# EAGLE design Motors-power-board (EAGLE 9.5.2)
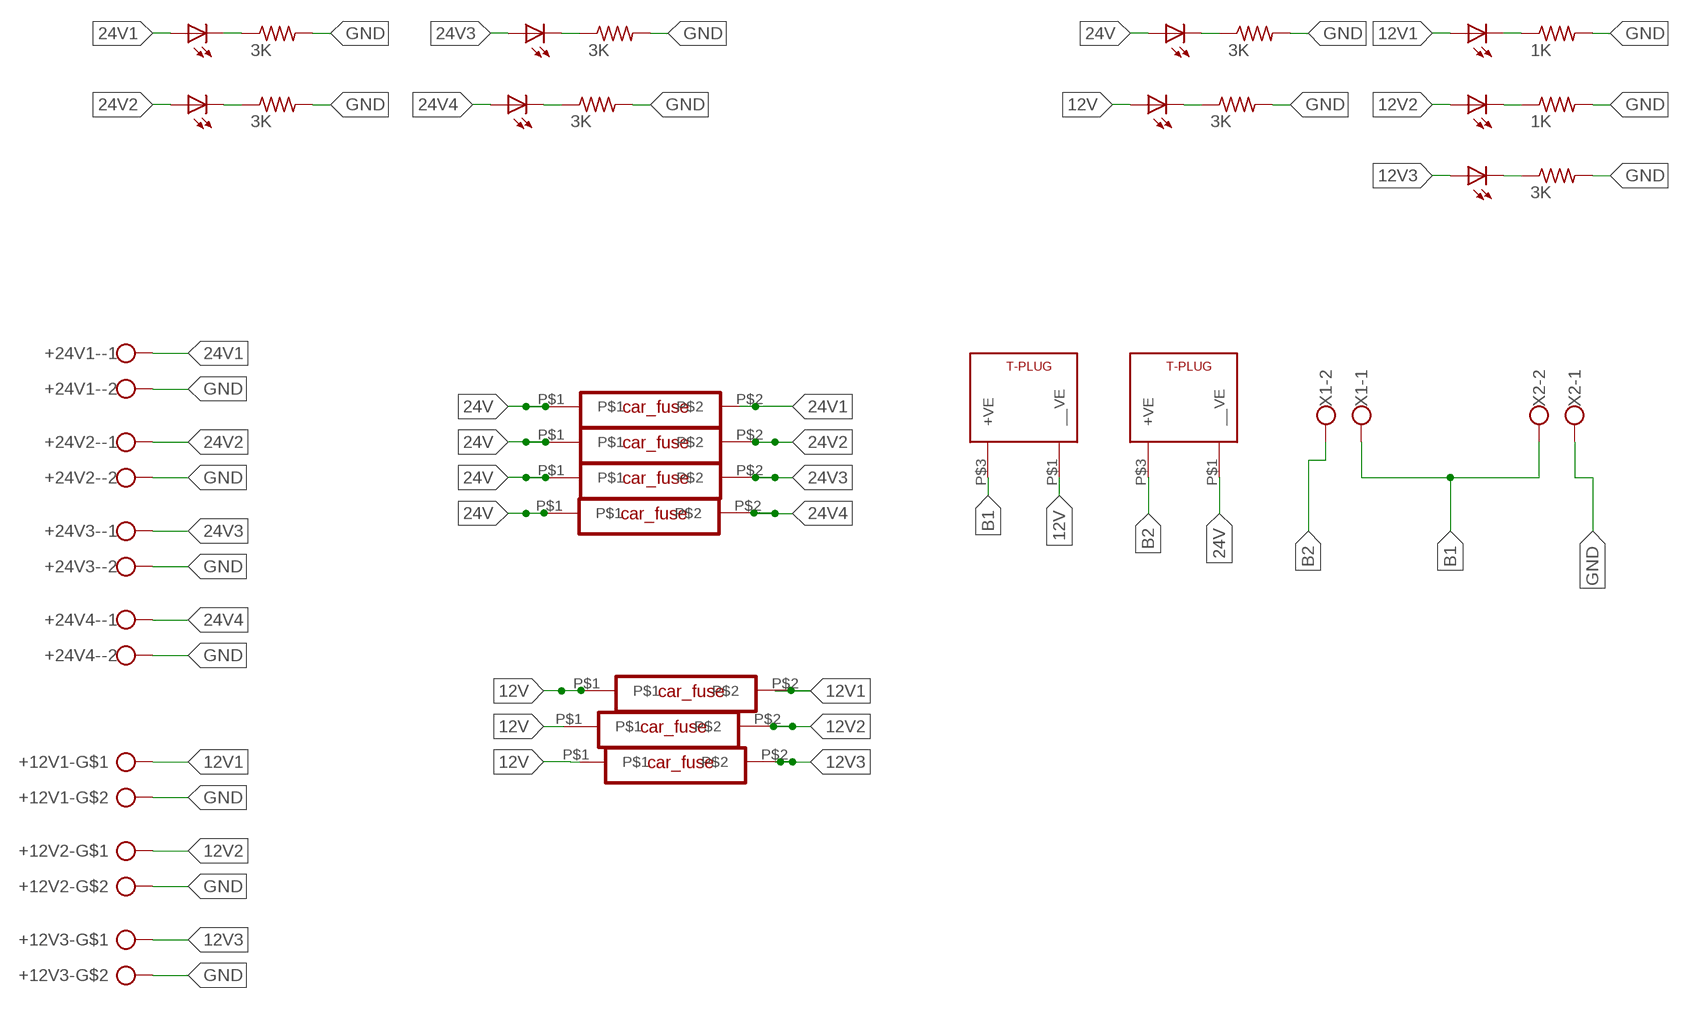
[diagram p0: schematic, sheet 1]

## Parts
1K1  3K  RES-7  [0204/7]
1K2  1K  RES-7  [0204/7]
+12V1-  CON_PTR_2  [AK300/2]
+12V2-  CON_PTR_2  [AK300/2]
+12V3-  CON_PTR_2  [AK300/2]
+24V1-  ROSTA.POWER  [W239-302]
+24V2-  ROSTA.POWER  [W239-302]
+24V3-  ROSTA.POWER  [W239-302]
+24V4-  ROSTA.POWER  [W239-302]
U$4  LED24V  LED3MM  [LED3MM]
U$5  T_CONNECTOR  [T-PLUG]
U$6  T_CONNECTOR  [T-PLUG]
U$8  3K  RES-7  [0204/7]
U$9  3K  RES-7  [0204/7]
U$10  CAR_FUSE  [CAR_FUSE]
U$11  CAR_FUSE  [CAR_FUSE]
U$12  CAR_FUSE  [CAR_FUSE]
U$13  CAR_FUSE  [CAR_FUSE]
U$14  CAR_FUSE  [CAR_FUSE]
U$15  CAR_FUSE  [CAR_FUSE]
U$16  CAR_FUSE  [CAR_FUSE]
U$18  LED5V2  LED3MM  [LED3MM]
U$19  LED5V1  LED3MM  [LED3MM]
U$20  LED24V  LED3MM  [LED3MM]
U$21  LED12V  LED3MM  [LED3MM]
U$22  3K  RES-7  [0204/7]
U$23  3K  RES-7  [0204/7]
U$24  3K  RES-7  [0204/7]
U$25  LED5V2  LED3MM  [LED3MM]
U$26  LED5V1  LED3MM  [LED3MM]
U$27  LED24V  LED3MM  [LED3MM]
U$28  LED24V  LED3MM  [LED3MM]
U$29  1K  RES-7  [0204/7]
U$31  3K  RES-7  [0204/7]
X1  ROSTA.POWER  [W239-302]
X2  ROSTA.POWER  [W239-302]

## Nets
12V: U$5.P$1(__VE) U$14.P$1 U$15.P$1 U$16.P$1 U$28.A
12V1: +12V1-.1 U$14.P$2 U$25.A
12V2: +12V2-.1 U$15.P$2 U$26.A
12V3: +12V3-.1 U$16.P$2 U$27.A
24V: U$4.A U$6.P$1(__VE) U$10.P$1 U$11.P$1 U$12.P$1 U$13.P$1
24V1: +24V1-.1 U$10.P$2 U$18.A
24V2: +24V2-.1 U$11.P$2 U$19.A
24V3: +24V3-.1 U$12.P$2 U$20.A
24V4: +24V4-.1 U$13.P$2 U$21.A
B1: U$5.P$3(+VE) X1.1 X2.2
B2: U$6.P$3(+VE) X1.2
GND: 1K1.2 1K2.2 +12V1-.2 +12V2-.2 +12V3-.2 +24V1-.2 +24V2-.2 +24V3-.2 +24V4-.2 U$8.2 U$9.2 U$22.2 U$23.2 U$24.2 U$29.2 U$31.2 X2.1
N$1: 1K1.1 U$18.K(C)
N$2: U$19.K(C) U$22.1
N$3: U$21.K(C) U$23.1
N$4: U$20.K(C) U$24.1
N$5: 1K2.1 U$25.K(C)
N$6: U$26.K(C) U$29.1
N$9: U$8.1 U$28.K(C)
N$10: U$4.K(C) U$9.1
N$12: U$27.K(C) U$31.1

## Library data of the parts
1K1 1K2 U$8 U$9 U$22-U$24 U$29 U$31 = MIA_LIBRARY-2-2-2:RES-7
+12V1- +12V2- +12V3- = MIA_LIBRARY-2-2-2:CON_PTR_2
+24V1- +24V2- +24V3- +24V4- X1 X2 = MIA_LIBRARY-2-2-2:ROSTA.POWER: WAGO SCREW CLAMP; OC_FARNELL: unknown; OC_NEWARK: unknown
U$4 U$18-U$21 U$25-U$28 = MIA_LIBRARY-2-2-2:LED3MM
U$5 U$6 = MIA_LIBRARY-2-2-2:T_CONNECTOR
U$10-U$16 = MIA_LIBRARY-2-2-2:CAR_FUSE

## Board
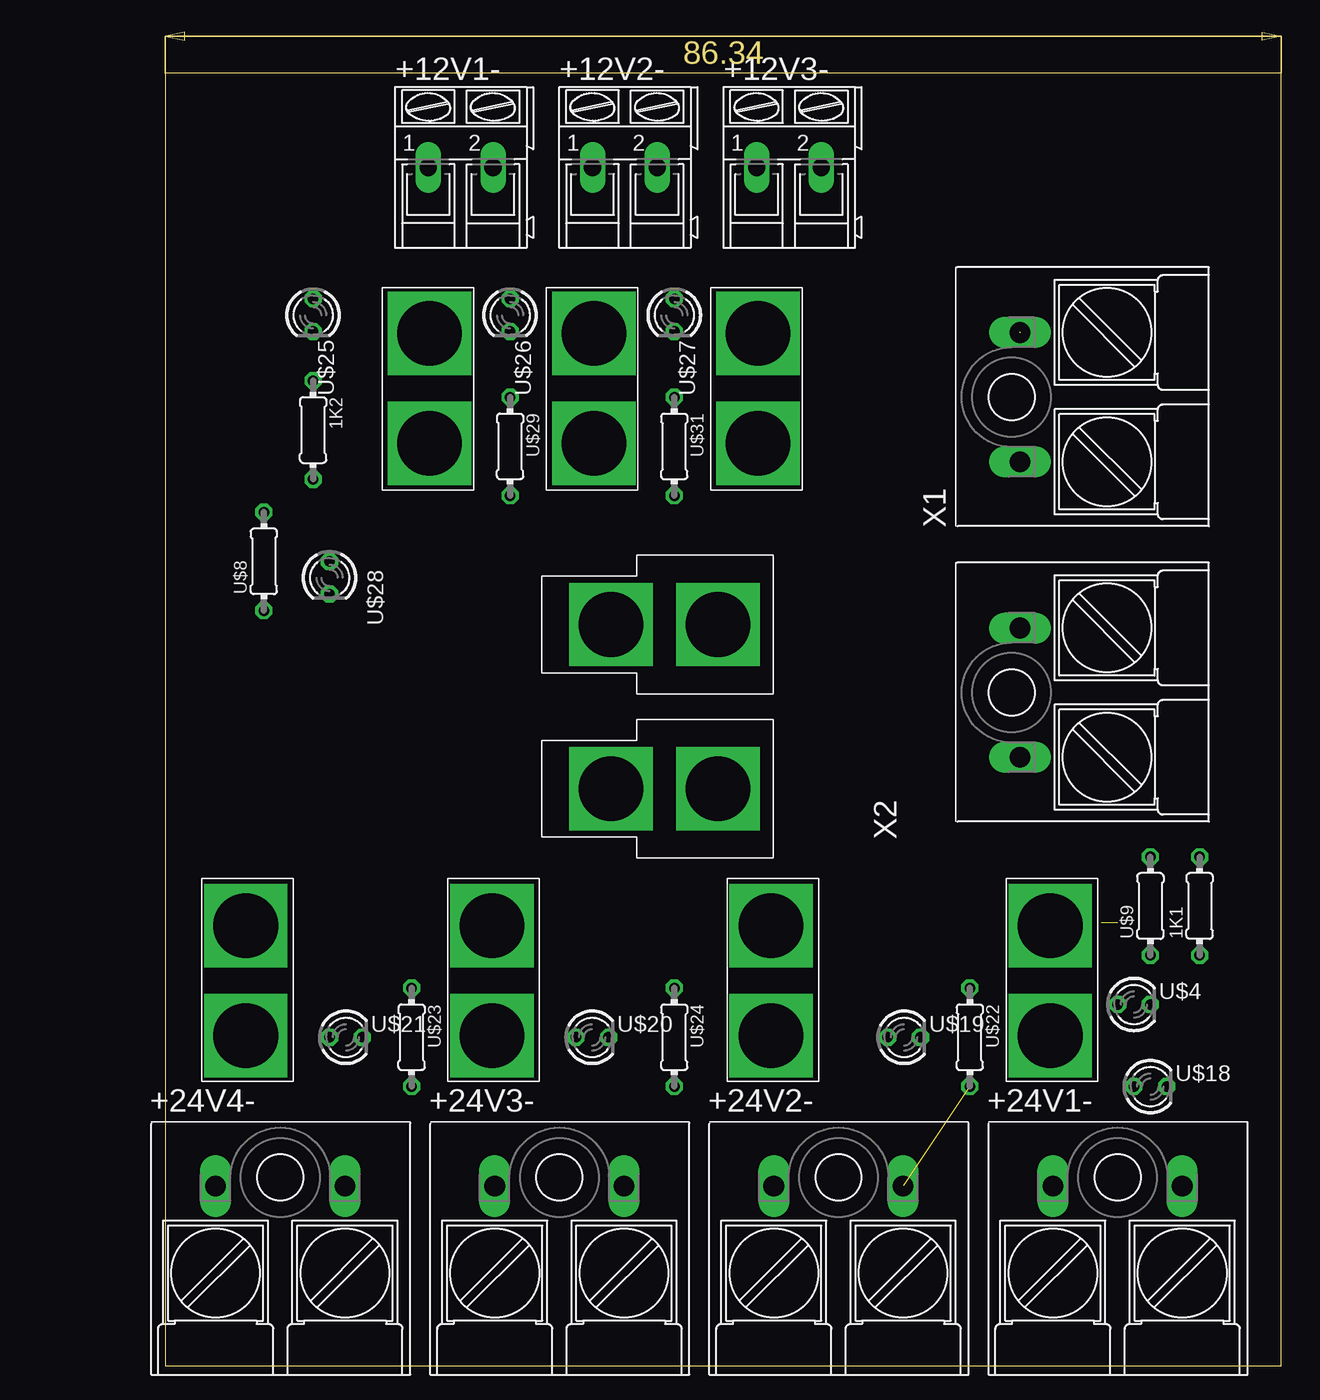
[diagram p1: board, top side]
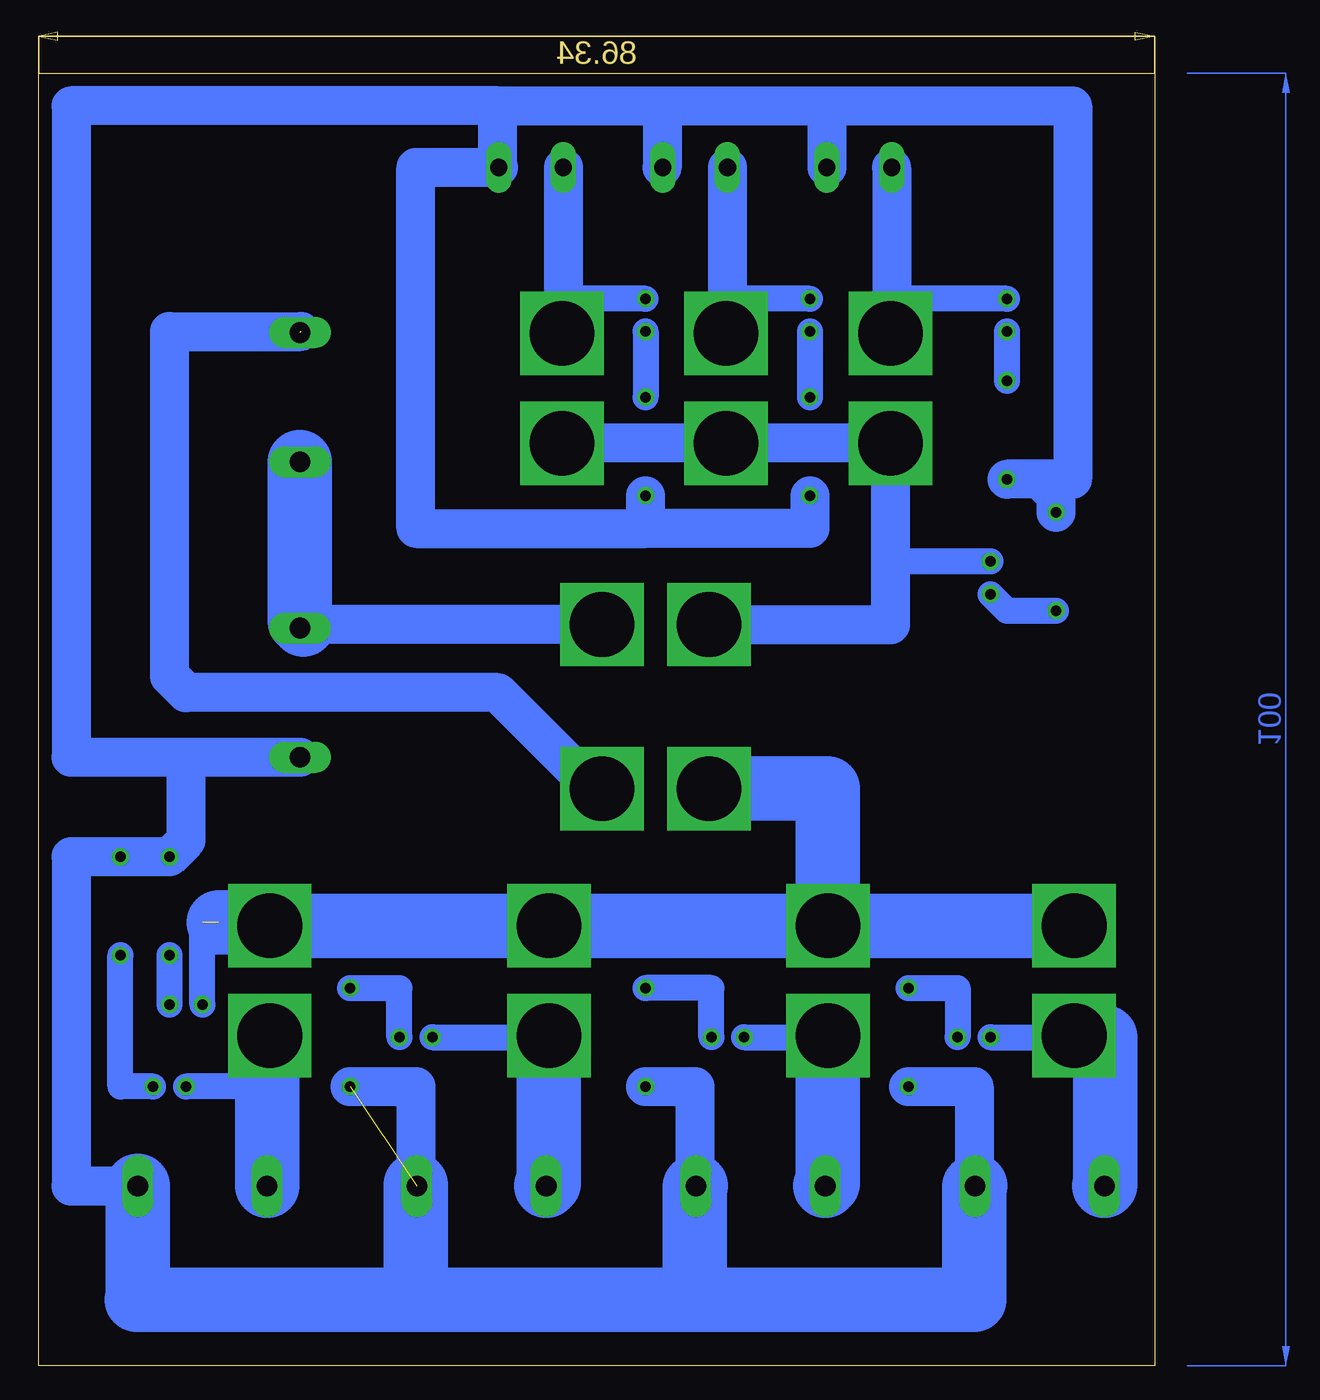
[diagram p2: board, bottom side, seen from below]

Size 86.34 x 100 mm. Coordinates in mm from the lower left corner, seen from the top.
Outline: 0,0 86.34,0 86.34,100 0,100 0,0
Copper layers (1*16): Top 0.035mm / dielectric 1.5mm / Bottom 0.035mm
Design rules "default *": minimum track width 0.4mm, minimum drill 0.4mm, track to track 6mil, track to pad 6mil, pad to pad 6mil, via to via 6mil, smd to smd 6mil, copper to edge 40mil, drill to drill 6mil, minimum pad ring 10mil, minimum via ring 8mil, stop-mask expansion 4mil, vias tented up to drill 0mil, thermal gap 10mil

### Footprints (pad centres in the part's own frame; a part is rotated, then mirrored left to right if it is on the bottom)
0204/7 = drill 0.813 octagon: 1 -3.81,0; 2 3.81,0
AK300/2 = drill 1.321 long: 1 -2.515,0; 2 2.489,0
W239-302 = drill 1.6 long: 1 -5,5; 2 5,5
LED3MM = drill 0.813 octagon: A -1.27,0; K 1.27,0
T-PLUG = drill 5 pad 6.452 square: P$1 -2.73,-4; P$3 -11,-4
CAR_FUSE = drill 5 pad 6.452 square: P$1 2.794,-0.127; P$2 11.303,-0.127

### Placement (x,y rotation side)
1K1  80.01,35.56 90 top
1K2  11.43,72.39 270 top
+12V1-  22.86,92.71 0 top
+12V2-  35.56,92.71 0 top
+12V3-  48.26,92.71 0 top
+24V1-  73.66,8.89 0 top
+24V2-  52.07,8.89 0 top
+24V3-  30.48,8.89 0 top
+24V4-  8.89,8.89 0 top
U$4  74.93,27.94 0 top
U$5  31.75,53.34 180 top
U$6  31.75,40.64 180 top
U$8  7.62,62.23 90 top
U$9  76.2,35.56 90 top
U$10  68.58,36.83 270 top
U$11  46.99,36.83 270 top
U$12  25.4,36.83 270 top
U$13  6.35,36.83 270 top
U$14  20.32,68.58 90 top
U$15  33.02,68.58 90 top
U$16  45.72,68.58 90 top
U$18  76.2,21.59 0 top
U$19  57.15,25.4 0 top
U$20  33.02,25.4 0 top
U$21  13.97,25.4 0 top
U$22  62.23,25.4 270 top
U$23  19.05,25.4 270 top
U$24  39.37,25.4 270 top
U$25  11.43,81.28 270 top
U$26  26.67,81.28 270 top
U$27  39.37,81.28 270 top
U$28  12.7,60.96 270 top
U$29  26.67,71.12 270 top
U$31  39.37,71.12 270 top
X1  71.12,74.93 90 top
X2  71.12,52.07 90 top

### Tracks (layer width: path | path; a pad name or v marks a point on that pad's centre or on a via)
12V
  Bottom 2: 24.13,57.15 34.29,57.15 U$5.P$1 | U$28.A 20.45,62.23
  Bottom 3: U$5.P$1 20.45,57.34 20.45,62.23 U$14.P$1 U$15.P$1 U$16.P$1
12V1
  Bottom 2: U$25.A 20.34,82.55
  Bottom 3: +12V1-.1 20.34,82.55 20.34,79.88 U$14.P$2
12V2
  Bottom 2: U$26.A 33.05,82.55
  Bottom 3: +12V2-.1 33.05,82.55 33.05,79.88 U$15.P$2
12V3
  Bottom 2: U$27.A 45.74,82.55
  Bottom 3: +12V3-.1 45.74,82.55 45.74,79.88 U$16.P$2
24V  (1 unrouted)
  Bottom 2: U$4.A 73.66,34.29
  Bottom 3: U$13.P$1 6.35,34.16 | U$6.P$1 34.29,44.45
  Bottom 5: U$13.P$1 U$12.P$1 | U$12.P$1 U$11.P$1 U$10.P$1 68.71,34.29 72.39,34.29 | U$6.P$1 25.27,44.64 U$12.P$1
24V1
  Bottom 2: U$10.P$2 68.58,25.53 68.58,21.59 U$18.A
  Bottom 5: +24V1-.1 68.66,25.53 U$10.P$2
24V2
  Bottom 2: U$19.A 46.86,25.4 U$11.P$2
  Bottom 5: +24V2-.1 46.86,14.1 U$11.P$2
24V3
  Bottom 2: U$20.A 25.27,25.4 U$12.P$2
  Bottom 5: +24V3-.1 25.27,14.1 U$12.P$2
24V4
  Bottom 2: U$21.A 6.35,25.4 3.81,25.4
  Bottom 5: 3.81,25.4 3.81,13.97 +24V4-.1 | U$13.P$2 6.35,25.4
B1
  Bottom 3: U$5.P$3 65.85,57.34 X2.2
  Bottom 5: X1.1 66.12,57.61 65.85,57.34
B2  (1 unrouted)
  Bottom 3: U$6.P$3 43.37,44.64 50.8,52.07 74.93,52.07 76.2,53.34 76.2,80.01 66.04,80.01
GND  (1 unrouted)
  Bottom 2: 38.1,92.71 +12V2-.2
  Bottom 3: 8.89,68.58 6.35,68.58 6.35,97.48 25.35,97.48 | 8.89,68.58 1K2.2 | U$29.2 26.67,64.77 39.37,64.77 | 39.37,64.77 U$31.2 | +12V3-.2 50.8,92.71 | 50.8,92.71 57.15,92.71 57.15,64.77 39.37,64.77 | 50.8,92.71 50.8,97.48 | 50.8,97.48 38.1,97.48 | 38.1,97.48 38.1,92.71 | 38.1,97.48 25.35,97.48 | 25.35,97.48 +12V1-.2 | X2.1 74.93,47.07 | 74.93,47.07 83.82,47.07 83.82,97.48 50.8,97.48 | +24V1-.2 83.82,13.89 83.82,39.37 U$9.2 | U$9.2 1K1.2 | U$23.2 13.97,21.59 13.97,13.81 | U$24.2 35.56,21.59 35.56,13.81 | U$22.2 57.15,21.59 57.15,13.97 | U$9.2 74.93,40.64 74.93,47.07 | U$8.2 7.62,67.31 8.89,68.58
  Bottom 5: +24V4-.2 13.97,13.81 13.97,5.08 35.56,5.08 | 35.56,5.08 35.56,13.81 +24V3-.2 | 35.56,5.08 57.15,5.08 | 57.15,13.97 57.15,5.08 | 78.66,5.08 +24V1-.2 | 78.66,5.08 78.74,5.08 | 78.66,5.08 57.15,5.08
N$1
  Bottom 2: U$18.K 80.01,21.59 1K1.1
N$2
  Bottom 2: U$19.K 58.42,29.21 U$22.1
N$3
  Bottom 2: U$23.1 15.24,29.21 U$21.K
N$4
  Bottom 2: U$20.K 34.29,29.21 U$24.1
N$5
  Bottom 2: U$25.K 1K2.1
N$6
  Bottom 2: U$26.K U$29.1
N$9
  Bottom 2: U$28.K 11.43,58.42 U$8.1
N$10
  Bottom 2: U$4.K U$9.1
N$12
  Bottom 2: U$27.K U$31.1
(copper drawn outside any net)
  shapes: Bottom area x1